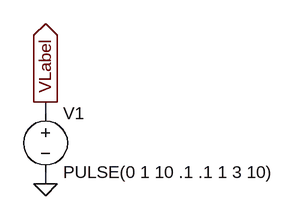
[diagram p0: schematic TestVoltageSource.asc]
TestVoltageSource.asc, the LTspice schematic file:
Version 4
SHEET 1 880 680
WIRE 64 64 64 48
WIRE 64 160 64 144
FLAG 64 48 VLabel
IOPIN 64 48 Out
FLAG 64 160 0
SYMBOL voltage 64 48 R0
WINDOW 123 0 0 Left 2
WINDOW 39 0 0 Left 2
SYMATTR InstName V1
SYMATTR Value PULSE(0 1 10 .1 .1 1 3 10)

The netlist it stands for:
* TestVoltageSource.asc
V1 VLabel 0 PULSE(0 1 10 .1 .1 1 3 10)
.backanno
.end